# EasyEDA Pro project IPM_12V分电板.eprj

# Schematic Schematic1
Board Name: Board1; Create Date: 2025-09-07; Page Name: P1; Project Name: IPM_12V分电板; Schematic Name: Schematic1; Update Date: 2025-09-14; Company: 嘉立创EDA; Page Size: A4; Version: V1.0
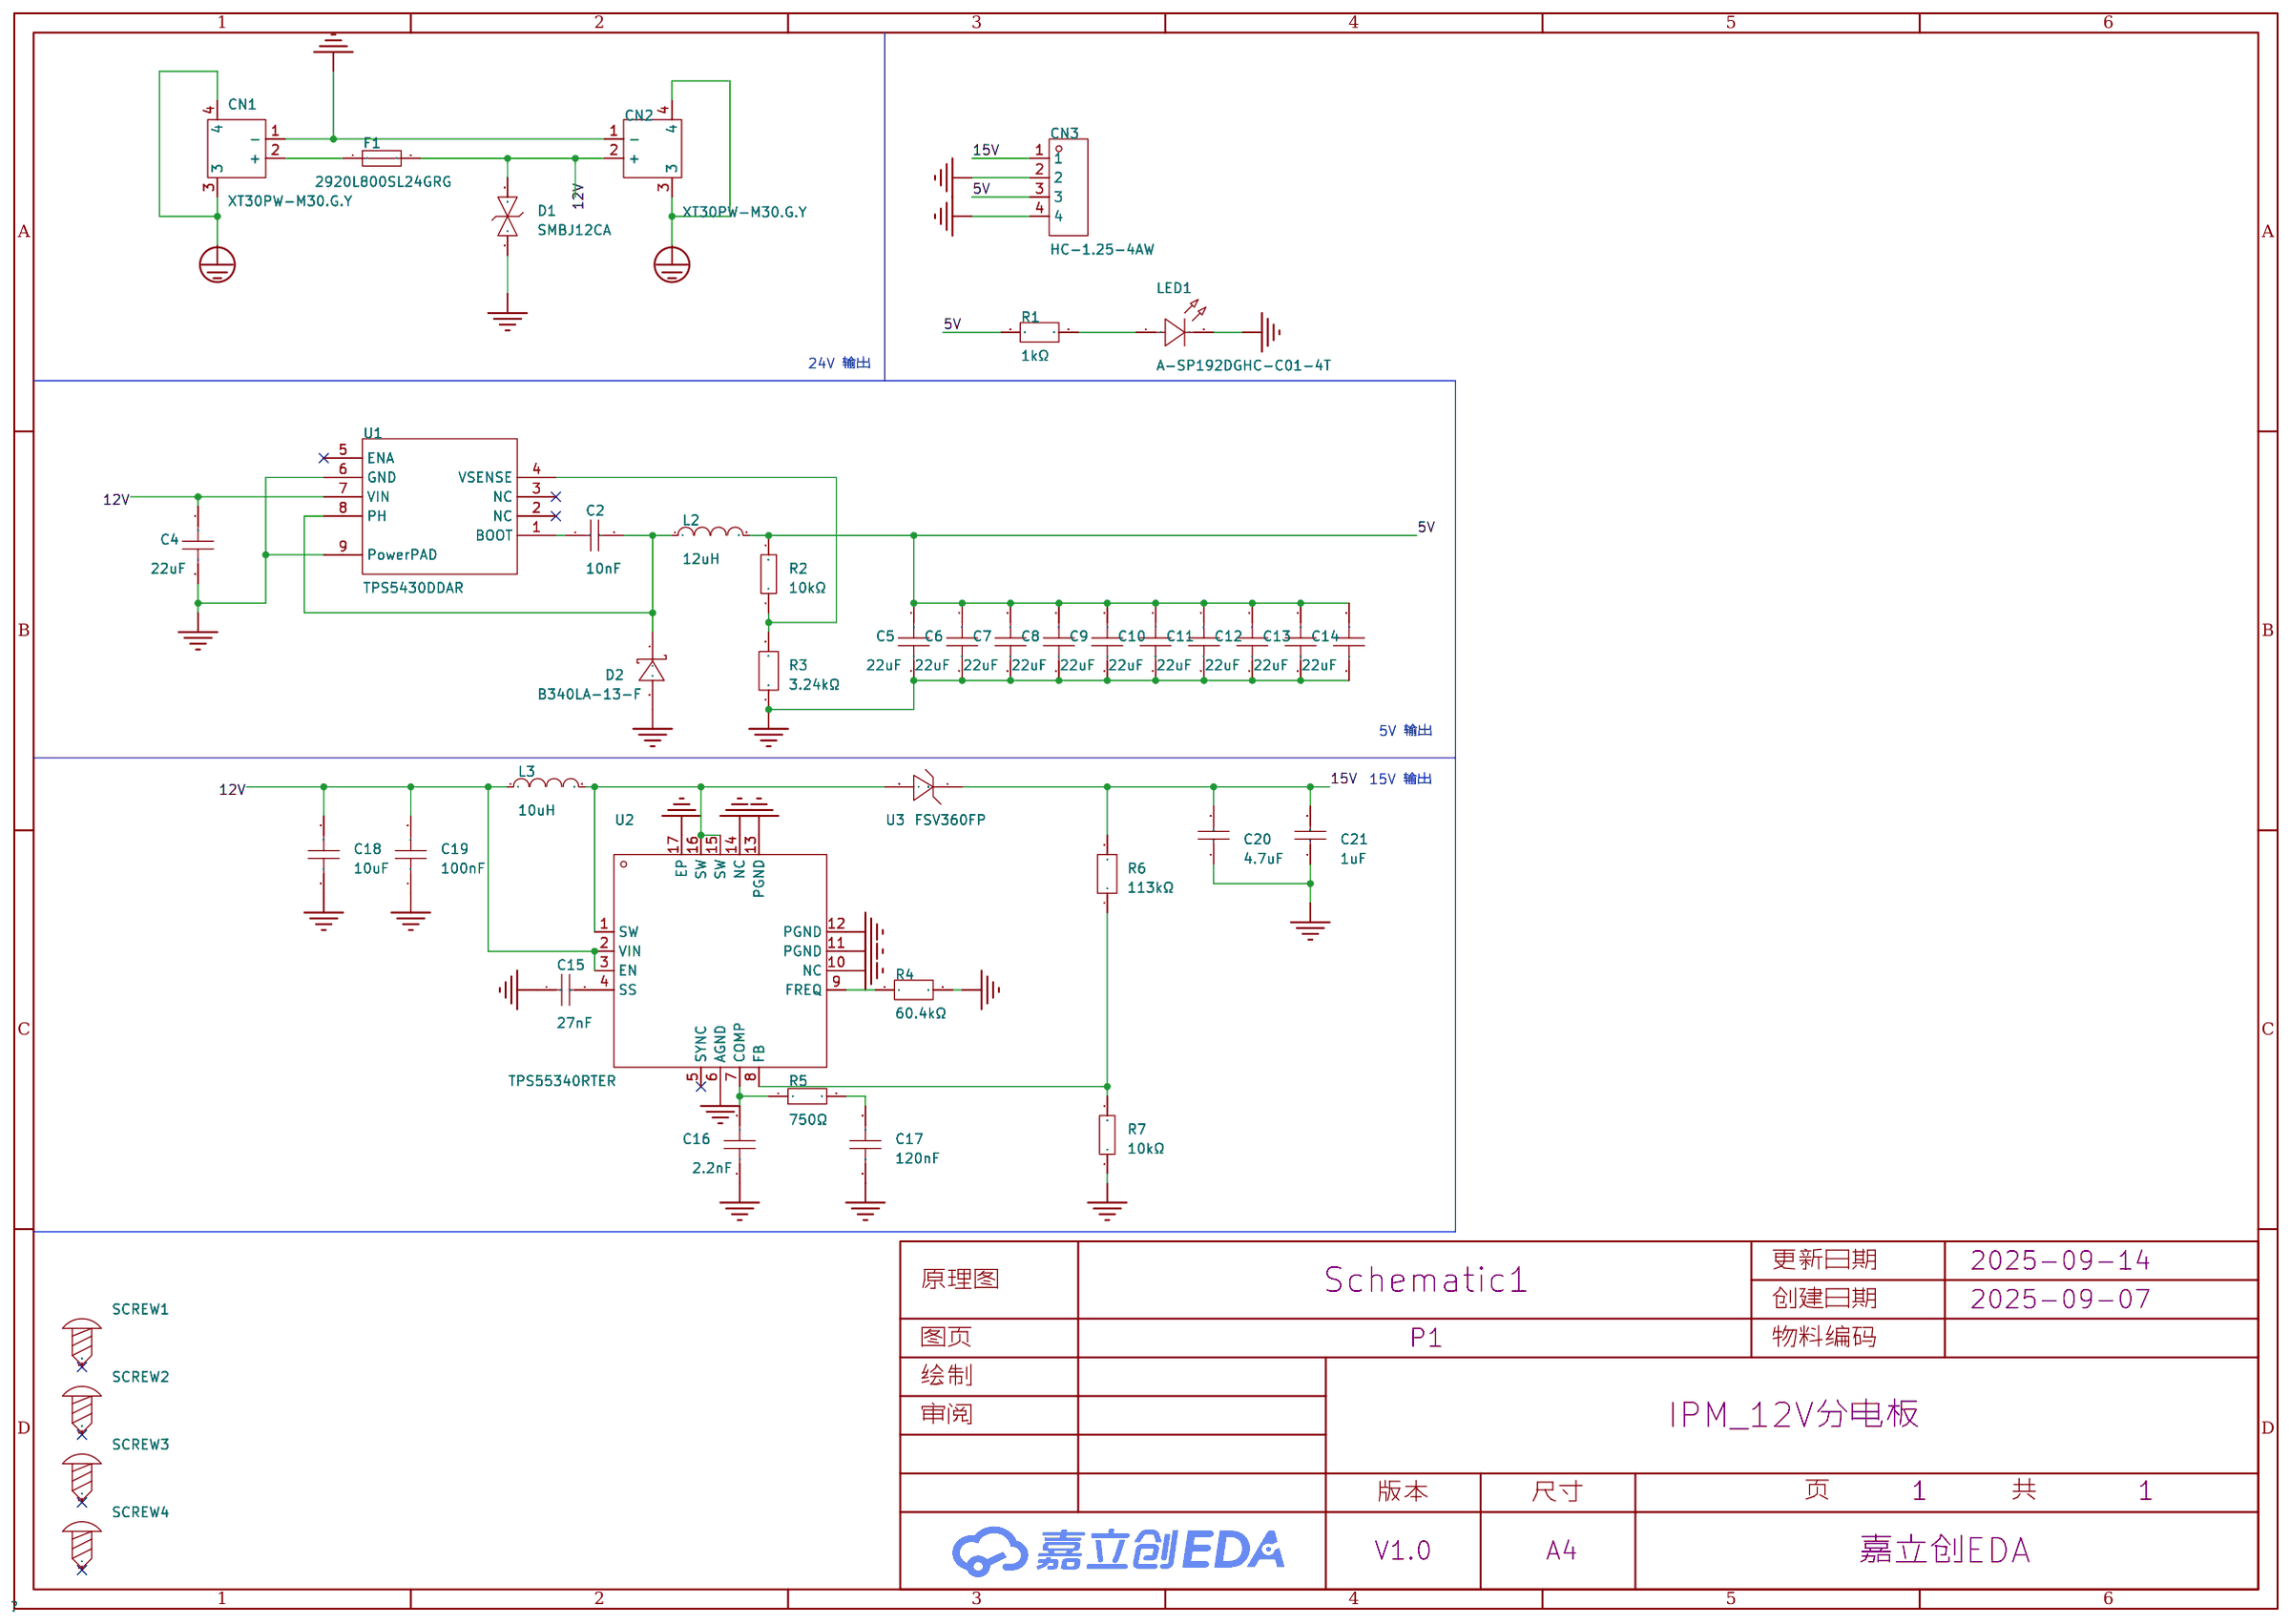
[diagram p0: schematic sheet]

## Parts
C2  10nF  [C0603]
C4  22uF  [C0603]
C5  22uF  [C0603]
C6  22uF  [C0603]
C7  22uF  [C0603]
C8  22uF  [C0603]
C9  22uF  [C0603]
C10  22uF  [C0603]
C11  22uF  [C0603]
C12  22uF  [C0603]
C13  22uF  [C0603]
C14  22uF  [C0603]
C15  27nF  [C0603]
C16  2.2nF  [C0603]
C17  120nF  [C0603]
C18  10uF  [C0603]
C19  100nF  [C0603]
C20  4.7uF  [C0805]
C21  1uF  [C0805]
CN1  XT30PW-M30.G.Y  [CONN-TH_XT30PW-M]
CN2  XT30PW-M30.G.Y  [CONN-TH_XT30PW-M]
CN3  HC-1.25-4AW  [CONN-TH_4P-P1.25_HCTL_HC-1.25-4AW]
D1  SMBJ12CA  [SMB_L4.6-W3.6-LS5.4-BI]
D2  B340LA-13-F  [SMA_L4.3-W2.6-LS5.2-RD]
F1  2920L800SL24GRG  [F2920]
L2  12uH  [IND-SMD_L8.0-W8.0_FNR80XXS]
L3  10uH  [IND-SMD_L5.4-W5.2_FXL0530]
LED1  A-SP192DGHC-C01-4T  [LED0603-FD]
R1  1kΩ  [R0603]
R2  10kΩ  [R0603]
R3  3.24kΩ  [R0603]
R4  60.4kΩ  [R0603]
R5  750Ω  [R0603]
R6  113kΩ  [R0603]
R7  10kΩ  [R0603]
SCREW1  -  [M2螺丝]
SCREW2  -  [M2螺丝]
SCREW3  -  [M2螺丝]
SCREW4  -  [M2螺丝]
U1  TPS5430DDAR  [ESOP-8_L4.9-W3.9-P1.27-LS6.0-TL-EP]
U2  TPS55340RTER  [VQFN-16_L3.0-W3.0-P0.50-BL-EP1.7]
U3  FSV360FP  [POWERDI-123_L2.8-W1.8-LS3.7-RD-1]

## Library data of the parts
C2 = CL10B103KB8NNNC: LCSC Part Name: 10nF ±10% 50V; Supplier Part: C1589; Manufacturer: SAMSUNG(三星); Supplier Footprint: 0603; JLCPCB Part Class: 扩展库; Datasheet: https://item.szlcsc.com/datasheet/CL10B103KB8NNNC/1941.html; Supplier: LCSC; Tolerance: ±10%; Voltage Rating: 50V; Temperature Coefficient: X7R
C4-C14 = CL10A226MO7JZNC: LCSC Part Name: 22uF ±20% 16V; Supplier Part: C2762594; Manufacturer: SAMSUNG(三星); Supplier Footprint: 0603; JLCPCB Part Class: 扩展库; Datasheet: https://item.szlcsc.com/datasheet/CL10A226MO7JZNC/2889856.html; Supplier: LCSC; Tolerance: ±20%; Voltage Rating: 16V; Temperature Coefficient: X5R
C15 = CC0603KRX7R9BB273: LCSC Part Name: 27nF ±10% 50V; Supplier Part: C107086; Manufacturer: YAGEO(国巨); Supplier Footprint: 0603; JLCPCB Part Class: 扩展库; Datasheet: https://item.szlcsc.com/datasheet/CC0603KRX7R9BB273/108302.html; Supplier: LCSC; Tolerance: ±10%; Voltage Rating: 50V; Temperature Coefficient: X7R
C16 = GRM1885C1H222JA01D: LCSC Part Name: 2.2nF ±5% 50V; Supplier Part: C77033; Manufacturer: muRata(村田); Supplier Footprint: 0603; JLCPCB Part Class: 扩展库; Datasheet: https://atta.szlcsc.com/upload/public/pdf/source/20200305/C490387_23319AE8C154DEB24C505E6C82A8106A.pdf; Supplier: LCSC; Tolerance: ±5%; Voltage Rated: 50V; Temperature Coefficient: C0G
C17 = CGA0603X7R124K500JT: LCSC Part Name: 120nF ±10% 50V; Supplier Part: C36911430; Manufacturer: HRE(芯声); Supplier Footprint: 0603; JLCPCB Part Class: 扩展库; Datasheet: https://atta.szlcsc.com/upload/public/pdf/source/20240730/28DD32980FC0791A6BDEF3FC10157BDF.pdf; Supplier: LCSC; Tolerance: ±10%; Voltage Rating: 50V; Temperature Coefficient: X7R
C18 = CL10A106MA8NRNC: LCSC Part Name: 10uF ±20% 25V; Supplier Part: C96446; Manufacturer: SAMSUNG(三星); Supplier Footprint: 0603; JLCPCB Part Class: 基础库; Datasheet: https://item.szlcsc.com/datasheet/CL10A106MA8NRNC/97651.html; Supplier: LCSC; Tolerance: ±20%; Voltage Rating: 25V; Temperature Coefficient: X5R
C19 = CL10B104KB8NNNC: LCSC Part Name: 100nF ±10% 50V; Supplier Part: C1591; Manufacturer: SAMSUNG(三星); Supplier Footprint: 0603; JLCPCB Part Class: 扩展库; Datasheet: https://item.szlcsc.com/datasheet/CL10B104KB8NNNC/1943.html; Supplier: LCSC; Tolerance: ±10%; Voltage Rating: 50V; Temperature Coefficient: X7R
C20 = CL21A475KBQNNNE: LCSC Part Name: 4.7uF ±10% 50V; Supplier Part: C98192; Manufacturer: SAMSUNG(三星); Supplier Footprint: 0805; JLCPCB Part Class: 扩展库; Datasheet: https://item.szlcsc.com/datasheet/CL21A475KBQNNNE/99401.html; Supplier: LCSC; Tolerance: ±10%; Voltage Rating: 50V; Temperature Coefficient: X5R
C21 = CL21B105KBFNNNE: LCSC Part Name: 1uF ±10% 50V; Supplier Part: C28323; Manufacturer: SAMSUNG(三星); Supplier Footprint: 0805; JLCPCB Part Class: 基础库; Datasheet: https://item.szlcsc.com/datasheet/CL21B105KBFNNNE/29074.html; Supplier: LCSC; Tolerance: ±10%; Voltage Rating: 50V; Temperature Coefficient: X7R
CN1 CN2 = XT30PW-M30.G.Y: 类别:-;类型1:-;; LCSC Part Name: AMASS(艾迈斯)航模插头 卧式弯脚 XT30PW-M公头; Supplier Part: C431092; Manufacturer: AMASS(艾迈斯); JLCPCB Part Class: 扩展库; Datasheet: https://atta.szlcsc.com/upload/public/pdf/source/20220222/6A9F22F7850E25B33E1BE430ADF8560B.pdf; Supplier: LCSC; Type: 航模插头; RatedVoltage: DC 500V; InterfaceType: 公头; RatedCurrent: 15A; RecommendedWireGauge: 16/18/20AWG; contact resistance: 1.2mΩ; specifications: 2pin
CN3 = HC-1.25-4AW: LCSC Part Name: 1x4P 间距:1.25mm 弯插 系列:PicoBlade(MX 1.25); Supplier Part: C2845537; Manufacturer: HCTL(华灿天禄); Supplier Footprint: 弯插,P=1.25mm; JLCPCB Part Class: 扩展库; Datasheet: https://item.szlcsc.com/datasheet/HC-1.25-4AW/3039218.html; Supplier: LCSC; Pins Structure: 1x4P; Pitch: 1.25mm; Mounting Type: 弯插; Reference Series: PicoBlade(MX 1.25); Number of Pins: 4P; Number of Rows: 1; Number of PINs Per Row: 4; Current Rating: 1A; Contact Material: 黄铜; Contact Plating: 锡; Operating Temperature: -25℃~+85℃; Voltage Rating: 125V; Plastic Material: PA46; Flame Retardant Rating: UL94V-0; Z-Height of the Board: 3.2mm; X-Length of Bottom Edge on Board (Spacing Line): 6.75mm; Y-Width of Bottom Edge on Board: 4.7mm
D1 = SMBJ12CA_C19077566: LCSC Part Name: 双向TVS 12V截止 峰值浪涌电流：30.15A@10/1000us; Supplier Part: C19077566; Manufacturer: R+O(宏嘉诚); Supplier Footprint: DO-214AA(SMB); JLCPCB Part Class: 扩展库; Datasheet: https://item.szlcsc.com/datasheet/SMBJ12CA/20275651.html; Supplier: LCSC; Polarity: 双向; Reverse Stand-Off Voltage (Vrwm): 12V; Clamping Voltage: 19.9V; Peak Pulse Current (Ipp): 30.15A@10/1000us; Peak Pulse Power Dissipation (Ppp): 600W@10/1000us; Voltage - Breakdown: 14.7V; Reverse Leakage Current (Ir): 5uA; Number of Channels: 单路; Operating Temperature: -55℃~+150℃; level of protection: IEC 61000-4-2; Type: TVS
D2 = B340LA-13-F: LCSC Part Name: 电压:40V 电流:3A; Supplier Part: C17101; Manufacturer: DIODES(美台); Supplier Footprint: SMA(DO-214AC); JLCPCB Part Class: 扩展库; Datasheet: https://atta.szlcsc.com/upload/public/pdf/source/20171023/C97318_15087455366241052881.pdf; Supplier: LCSC; Forward Voltage (Vf@If): 450mV@3A; Reverse Voltage (Vr): 40V; Average Rectified Current (Io): 3A; Reverse Leakage Current (Ir): 2mA@40V
F1 = 2920L800SL24GRG: LCSC Part Name: 24V 8.00A 2920 低内阻; Supplier Part: C47345588; Manufacturer: LUTE(陆特); Supplier Footprint: 2920; JLCPCB Part Class: 扩展库; Datasheet: https://item.szlcsc.com/datasheet/2920L800SL24GRG/49561096.html; Supplier: LCSC; Voltage - Max: 24V; Current - Max: 50A; Hold Current: 8A; Trip Current: 16A; Power Dissipation: 2W; Resistance - Initial (Ri) (Min): 0.6mΩ; Resistance - Post Trip (R1) (Max): 0.8mΩ; Time to Trip(Max): 5s; Operating Temperature: -40℃~+85℃
L2 = FNR8040S120MT: LCSC Part Name: 12uH ±20% 4A; Supplier Part: C168128; Manufacturer: cjiang(长江微电); Supplier Footprint: SMD,8x8mm; JLCPCB Part Class: 扩展库; Datasheet: https://atta.szlcsc.com/upload/public/pdf/source/20190327/C167925_9EFF0AABC4CA629C2CC95961DBF7D39D.pdf; Supplier: LCSC; Tolerance: ±20%; Current Rating: 3A; Current - Saturation(Isat): 4A; DC Resistance(DCR): 53mΩ; Type: 磁胶屏蔽绕线合金电感
L3 = FXL0530-100-M: LCSC Part Name: 10uH ±20% 3.5A; Supplier Part: C177248; Manufacturer: cjiang(长江微电); Supplier Footprint: SMD,5.4x5.2mm; JLCPCB Part Class: 扩展库; Datasheet: https://item.szlcsc.com/datasheet/FXL0530-100-M/188640.html; Supplier: LCSC; Tolerance: ±20%; Current Rating: 3.2A; Current - Saturation(Isat): 3.5A; DC Resistance(DCR): 125mΩ; Type: 一体成型电感
LED1 = A-SP192DGHC-C01-4T: LCSC Part Name: 0603高亮绿灯正贴; Supplier Part: C19171301; Manufacturer: Amicc(欧密格光电); Supplier Footprint: 0603; JLCPCB Part Class: 扩展库; Datasheet: https://atta.szlcsc.com/upload/public/pdf/source/20231108/CAA90604E374CB6B31BBE970B55159E7.pdf; Supplier: LCSC; Emitted Color: 绿色; Forward Voltage (VF): 2.4V~3V; Power Dissipation: 70mW; Dominant Wavelength: 520nm~535nm; Lens Color: 无色透明透镜; Luminous Intensity: 225mcd~450mcd; Viewing Angle: 120°; Mounting Sytle: 正贴; Operating Temperature: -40℃~+85℃
R1 = FRC0603F1001TS: LCSC Part Name: 1kΩ ±1% 100mW 厚膜电阻; Supplier Part: C2907002; Manufacturer: FOJAN(富捷); Supplier Footprint: 0603; JLCPCB Part Class: 扩展库; Supplier: LCSC; Type: 厚膜电阻; Tolerance: ±1%; Power(Watts): 100mW; Voltage-Supply(Max): 75V; Temperature Coefficient: ±100ppm/℃; Operating Temperature: -55℃~+155℃
R2 R7 = 0603WAF1002T5E: LCSC Part Name: 厚膜电阻 10kΩ ±1% 100mW; Supplier Part: C25804; Manufacturer: UNI-ROYAL(厚声); Supplier Footprint: 0603; JLCPCB Part Class: 基础库; Datasheet: https://item.szlcsc.com/datasheet/0603WAF1002T5E/26547.html; Supplier: LCSC; Type: 厚膜电阻; Tolerance: ±1%; Power(Watts): 100mW; Voltage-Supply(Max): 75V; Temperature Coefficient: ±100ppm/℃; Operating Temperature: -55℃~+155℃
R3 = FRC0603F3241TS: LCSC Part Name: 3.24kΩ ±1% 100mW 厚膜电阻; Supplier Part: C2933197; Manufacturer: FOJAN(富捷); Supplier Footprint: 0603; JLCPCB Part Class: 扩展库; Datasheet: https://item.szlcsc.com/datasheet/FRC0603F3241TS/3279299.html; Supplier: LCSC; Type: 厚膜电阻; Tolerance: ±1%; Power(Watts): 100mW; Voltage-Supply(Max): 75V; Temperature Coefficient: ±100ppm/℃; Operating Temperature: -55℃~+155℃
R4 = RT0603BRD0760K4L: LCSC Part Name: 薄膜电阻 60.4kΩ ±0.1% 100mW; Supplier Part: C861495; Manufacturer: YAGEO(国巨); Supplier Footprint: 0603; JLCPCB Part Class: 扩展库; Datasheet: https://item.szlcsc.com/datasheet/RT0603BRD0760K4L/921833.html; Supplier: LCSC; Type: 薄膜电阻; Tolerance: ±0.1%; Power(Watts): 100mW; Temperature Coefficient: ±25ppm/℃; Operating Temperature: -55℃~+155℃
R5 = PTFR0603B750RP9: LCSC Part Name: 薄膜电阻 750Ω ±0.1% 100mW; Supplier Part: C351629; Manufacturer: RESI(开步睿思); Supplier Footprint: 0603; JLCPCB Part Class: 扩展库; Datasheet: https://atta.szlcsc.com/upload/public/pdf/source/20240506/11BDC7478D84177AC2A5326A65B6EB29.pdf; Supplier: LCSC; Type: 薄膜电阻; Tolerance: ±0.1%; Power(Watts): 100mW; Voltage-Supply(Max): 100V; Temperature Coefficient: ±25ppm/℃; Operating Temperature: -55℃~+125℃
R6 = RT0603BRD07113KL: LCSC Part Name: 薄膜电阻 113kΩ ±0.1% 100mW; Supplier Part: C705718; Manufacturer: YAGEO(国巨); Supplier Footprint: 0603; JLCPCB Part Class: 扩展库; Datasheet: https://atta.szlcsc.com/upload/public/pdf/source/20250609/0E6D5617EADA80FA3B707391883DF2D5.pdf; Supplier: LCSC; Type: 薄膜电阻; Tolerance: ±0.1%; Power(Watts): 100mW; Voltage-Supply(Max): 75V; Temperature Coefficient: ±25ppm/℃; Operating Temperature: -55℃~+155℃
SCREW1-SCREW4 = M2螺丝: Supplier Footprint: 插件
U1 = TPS5430DDAR: LCSC Part Name: 宽输入范围、3A输出电流的降压转换器; Supplier Part: C9864; Manufacturer: TI(德州仪器); Supplier Footprint: SOIC-8-EP; JLCPCB Part Class: 基础库; Datasheet: https://www.ti.com/cn/lit/gpn/tps5430; Supplier: LCSC; Function: 降压型; Output Type: 可调; Input Voltage: 5.5V~36V; Output Voltage: 1.221V~32.04V; Output Current: 3A; Switching Frequency: 500kHz; Operating Temperature: -40℃~+125℃@(TJ); Synchronous Rectification: 否; Number of Outputs: 1; Topology: 降压式; Switch tube (built-in/external): 内置
U2 = TPS55340RTER: LCSC Part Name: 5A 40V 非同步降压转换器; Supplier Part: C169167; Manufacturer: TI(德州仪器); Supplier Footprint: WQFN-16-EP(3x3); JLCPCB Part Class: 扩展库; Datasheet: https://www.ti.com/cn/lit/gpn/tps55340; Supplier: LCSC; Function: 升压型; Output Type: 可调; Voltage - Supply: 2.9V~32V; Output Voltage: 2.9V~38V; Output Current: 5.25A; Frequency - Switching: 1.14MHz; Operating Temperature: -40℃~+125℃@(TA); Synchronous Rectifier: 否; Number of Outputs: 1; Topology: 升压式；SEPIC；反激式; Switch tube (built-in/external): 内置
U3 = FSV360FP: LCSC Part Name: 电压:60V 电流:3A; Supplier Part: C891303; Manufacturer: onsemi(安森美); Supplier Footprint: SOD-123HE; JLCPCB Part Class: 扩展库; Datasheet: https://atta.szlcsc.com/upload/public/pdf/source/20210806/C891303_88CAC5C1F49EACDD3A0D3D95F29CFB22.pdf; Supplier: LCSC; Diode Configuration: 独立式; Forward Voltage (Vf) @ If: 650mV@3A; Reverse Voltage (Vr): 60V; Rectified Current: 3A; Reverse Leakage Current: 100uA@60V

## Nets
5V: C5.1 C6.1 C7.1 C8.1 C9.1 C10.1 C11.1 C12.1 C13.1 C14.1 CN3.3 L2.2 R1.1 R2.2
12V: C4.1 C18.2 C19.2 CN2.2(+) D1.2 F1.2 L3.1 U1.7(VIN) U2.2(VIN) U2.3(EN)
15V: C20.2 C21.2 CN3.1 R6.2 U3.1(C)
GND: C4.2 C5.2 C6.2 C7.2 C8.2 C9.2 C10.2 C11.2 C12.2 C13.2 C14.2 C15.1 C16.1 C17.1 C18.1 C19.1 C20.1 C21.1 CN1.1(-) CN2.1(-) CN3.2 CN3.4 D1.1 D2.2(A) LED1.2(K) R3.1 R4.2 R7.1 U1.6(GND) U1.9(PowerPAD) U2.6(AGND) U2.10(NC) U2.11(PGND) U2.12(PGND) U2.13(PGND) U2.14(NC) U2.17(EP)
PGND: CN1.3 CN1.4 CN2.3 CN2.4
$1N1431: C2.2 D2.1(K) L2.1 U1.8(PH)
$1N1787: R2.1 R3.2 U1.4(VSENSE)
$1N3489: LED1.1(A) R1.2
$1N5102: CN1.2(+) F1.1
$1N5856: C2.1 U1.1(BOOT)
$1N7867: L3.2 U2.1(SW) U2.15(SW) U2.16(SW) U3.2(A)
$1N8053: C15.2 U2.4(SS)
$1N8197: R4.1 U2.9(FREQ)
$1N8300: C16.2 R5.1 U2.7(COMP)
$1N8474: C17.2 R5.2
$1N9029: R6.1 R7.2 U2.8(FB)

Not connected (* = marked no-connect by the designer): SCREW1 1*; SCREW2 1*; SCREW3 1*; SCREW4 1*; U1 2(NC)* 3(NC)* 5(ENA)*; U2 5(SYNC)*

## Notes on the sheet
- 24V 输出
- 5V 输出
- 15V 输出

# Board PCB1
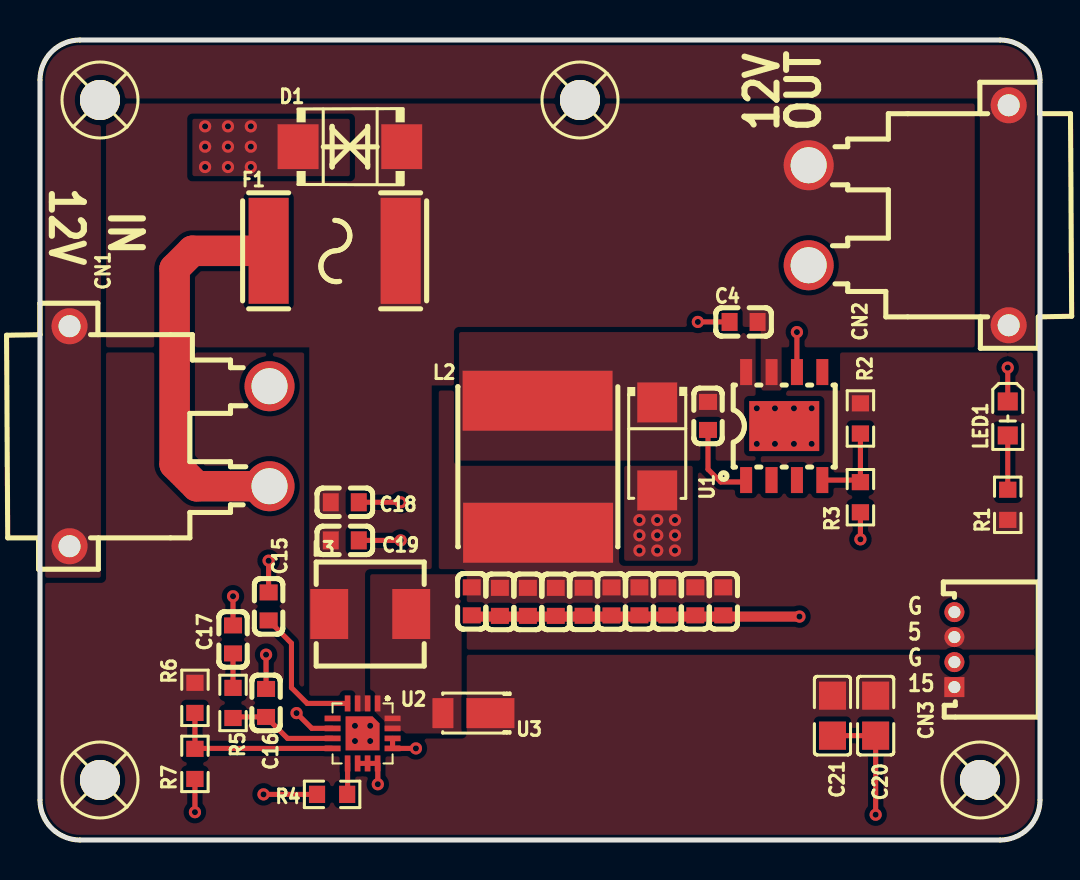
[diagram p1: board, top side]
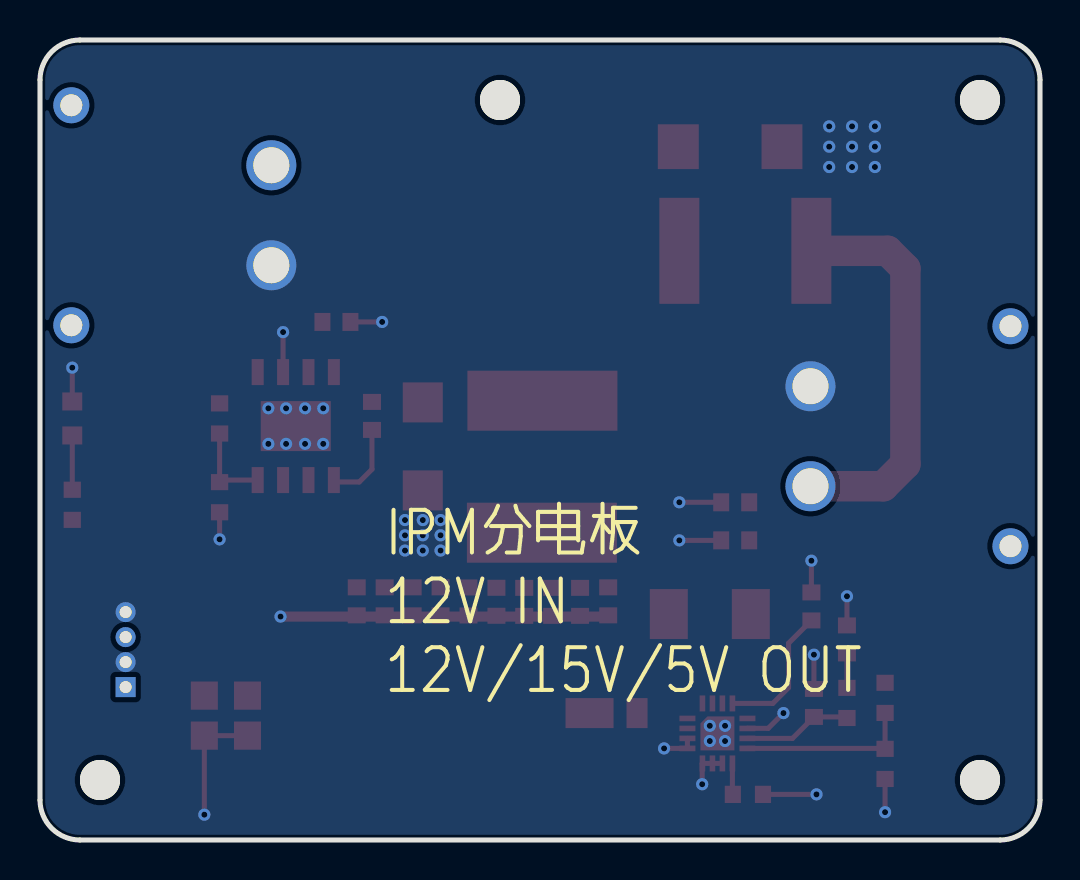
[diagram p2: board, bottom side, seen from below]

Outline 50 x 40 mm; copper layers: Top Layer, Bottom Layer. Coordinates in mm from the lower left corner of the outline.
Outline path: 0,38 0,2 arc(0.59,0.59) 2,0 48,0 arc(49.41,0.59) 50,2 50,38 arc(49.41,39.41) 48,40 2,40 arc(0.59,39.41) 0,38
Stack: Top Layer 0.035mm / Dielectric1 1.51mm FR4 er 4.5 / Bottom Layer 0.035mm

## Design rules (mm)
template: 自定义配置
spacing copperThickness1oz (default): track to track 0.102, other pairs 0.152 to 0.3
spacing copperThickness2oz: track to track 0.203, other pairs 0.152 to 0.3
track width copperThickness1oz (default): min 0.127, default 0.254, max 2.54
track width copperThickness2oz: min 0.203, default 0.254, max 2.54
differential pair differentialPair (default): width min 0.127, default 0.254, max 2.54; gap min 0.152, default 0.152
via viaSize (default): diameter min 0.5, default 0.61, max 10; hole min 0.3, default 0.305, max 6.3

## Placement (name value [footprint] x y rotation side)
C2  10nF  [C0603]  33.4 21.2 90 top
C4  22uF  [C0603]  35.18 25.9 180 top
C5  22uF  [C0603]  32.77 11.93 270 top
C6  22uF  [C0603]  31.37 11.93 270 top
C7  22uF  [C0603]  34.16 11.93 270 top
C8  22uF  [C0603]  28.57 11.93 270 top
C9  22uF  [C0603]  23 11.91 270 top
C10  22uF  [C0603]  21.59 11.93 270 top
C11  22uF  [C0603]  24.39 11.91 270 top
C12  22uF  [C0603]  25.79 11.91 270 top
C13  22uF  [C0603]  27.18 11.91 270 top
C14  22uF  [C0603]  29.97 11.93 270 top
C15  27nF  [C0603]  11.43 11.68 270 top
C16  2.2nF  [C0603]  11.3 6.85 270 top
C17  120nF  [C0603]  9.65 10.03 270 top
C18  10uF  [C0603]  15.24 16.89 180 top
C19  100nF  [C0603]  15.24 14.98 180 top
C20  4.7uF  [C0805]  41.78 6.22 90 top
C21  1uF  [C0805]  39.62 6.22 90 top
CN1  XT30PW-M30.G.Y  [CONN-TH_XT30PW-M]  6.48 20.19 270 top
CN2  XT30PW-M30.G.Y  [CONN-TH_XT30PW-M]  43.43 31.24 90 top
CN3  HC-1.25-4AW  [CONN-TH_4P-P1.25_HCTL_HC-1.25-4AW]  45.72 9.52 90 top
D1  SMBJ12CA  [SMB_L4.6-W3.6-LS5.4-BI]  15.49 34.67 0 top
D2  B340LA-13-F  [SMA_L4.3-W2.6-LS5.2-RD]  30.86 19.68 270 top
F1  2920L800SL24GRG  [F2920]  14.73 29.46 0 top
L2  12uH  [IND-SMD_L8.0-W8.0_FNR80XXS]  24.89 18.66 270 top
L3  10uH  [IND-SMD_L5.4-W5.2_FXL0530]  16.51 11.3 0 top
LED1  A-SP192DGHC-C01-4T  [LED0603-FD]  48.39 21.08 90 top
R1  1kΩ  [R0603]  48.39 16.76 90 top
R2  10kΩ  [R0603]  41.02 21.08 90 top
R3  3.24kΩ  [R0603]  41.02 17.14 90 top
R4  60.4kΩ  [R0603]  14.6 2.28 180 top
R5  750Ω  [R0603]  9.65 6.85 90 top
R6  113kΩ  [R0603]  7.75 7.11 90 top
R7  10kΩ  [R0603]  7.75 3.81 90 top
SCREW1  -  [M2螺丝]  3 37 0 top
SCREW2  -  [M2螺丝]  3 3 0 top
SCREW3  -  [M2螺丝]  47 3 0 top
SCREW4  -  [M2螺丝]  27 37 0 top
U1  TPS5430DDAR  [ESOP-8_L4.9-W3.9-P1.27-LS6.0-TL-EP]  37.21 20.7 90 top
U2  TPS55340RTER  [VQFN-16_L3.0-W3.0-P0.50-BL-EP1.7]  16.13 5.33 180 top
U3  FSV360FP  [POWERDI-123_L2.8-W1.8-LS3.7-RD-1]  21.34 6.34 180 top

## Footprints (pads in the part's own frame, mm; a bottom-side part is the same pattern mirrored in y, then rotated)
C0603
  rect 0.8x0.9 smd: 1(-0.7,0) 2(0.7,0)
C0805
  rect 1.41x1.35 smd: 1(-1,0) 2(1,0)
CONN-TH_4P-P1.25_HCTL_HC-1.25-4AW
  rect 1x1 hole 0.6: 1(-1.875,0)
  round 1 hole 0.6: 2(-0.625,0) 3(0.625,0) 4(1.875,0)
CONN-TH_XT30PW-M
  round 2.5 hole 1.8: 1(-2.5,5) 2(2.5,5)
  round 1.8 hole 1.1: 3(5.5,-5) 4(-5.5,-5)
ESOP-8_L4.9-W3.9-P1.27-LS6.0-TL-EP
  rect 1.3x0.6 smd: 1(-2.7,1.905) 2(-2.7,0.635) 3(-2.7,-0.635) 4(-2.7,-1.905) 5(2.7,-1.905) 6(2.7,-0.635) 7(2.7,0.635) 8(2.7,1.905)
  rect 2.5x3.5 smd: 9(0,0)
F2920
  rect 2x5.3 smd: 1(-3.3,0) 2(3.3,0)
IND-SMD_L5.4-W5.2_FXL0530
  rect 1.9x2.5 smd: 1(-2.05,0) 2(2.05,0)
IND-SMD_L8.0-W8.0_FNR80XXS
  rect 3x7.5 smd: 1(-3.3,-0.013) 2(3.3,0.013)
LED0603-FD
  rect 0.9x1 smd: 1(-0.85,0) 2(0.85,0)
M2螺丝
  round 2 hole 2: 1(0,0)
POWERDI-123_L2.8-W1.8-LS3.7-RD-1
  rect 2.4x1.5 smd: 1(-1.188,0)
  rect 1.05x1.5 smd: 2(1.188,0)
R0603
  rect 0.806x0.864 smd: 1(-0.753,0) 2(0.753,0)
SMA_L4.3-W2.6-LS5.2-RD
  rect 2x2 smd: 1(-2.2,0) 2(2.2,0)
SMB_L4.6-W3.6-LS5.4-BI
  rect 2.047x2.241 smd: 1(-2.591,0) 2(2.591,0)
VQFN-16_L3.0-W3.0-P0.50-BL-EP1.7
  rect 0.28x0.8 smd: 1(-0.749,-1.5) 2(-0.249,-1.5) 3(0.249,-1.5) 4(0.75,-1.5) 9(0.75,1.5) 10(0.249,1.5) 11(-0.249,1.5) 12(-0.749,1.5)
  rect 0.8x0.28 smd: 5(1.5,-0.749) 6(1.5,-0.249) 7(1.5,0.249) 8(1.5,0.75) 13(-1.5,0.75) 14(-1.5,0.249) 15(-1.5,-0.249) 16(-1.5,-0.749)
  custom 1.7x1.7 smd: 17(0,0)

## Nets
As in the schematic.

Pads without a net: SCREW1 1; SCREW2 1; SCREW3 1; SCREW4 1; U1 2 3 5; U2 5

## Via types
v1: diameter 0.61, hole 0.305, Top Layer to Bottom Layer, 46 vias

## Routing (per net, layer and track width the routed paths; a pad name or vN(x,y) marks a point on that pad's centre or on a via; arc(x,y) is an arc through that point)
GND: length 48.3
  Top Layer w0.254: R3.1 v1(41.02,15.03) ; v1(16.89,2.79) 16.89,3.82 U2.12 U2.11 U2.10 ; C18.1 v1(18.03,16.89) ; C16.1 v1(11.3,9.27) ; C21.1 C20.1 v1(41.78,1.27) ; U2.6 14.62,5.58 13.59,5.58 v1(12.83,6.34) ; C4.2 v1(32.89,25.9) ; U2.14 U2.13 v1(18.8,4.58) ; C15.1 v1(11.43,13.97) ; 48.39,21.93 v1(48.39,23.62) ; R7.1 v1(7.75,1.39) ; v1(37.85,25.39) U1.6 ; C17.1 v1(9.65,12.19) ; R4.2 v1(11.18,2.28) ; C19.1 v1(18.03,14.98)
  Top Layer w0.508: v1(37.97,11.17) 21.65,11.17 C10.2
  vias: v1(8.25,35.68) v1(8.25,34.67) v1(8.25,33.65) v1(9.4,35.68) v1(9.4,34.67) v1(9.4,33.65) v1(10.54,35.68) v1(10.54,34.67) v1(10.54,33.65) v1(15.75,5.71) v1(15.75,4.95) v1(16.51,5.71) v1(16.51,4.95) v1(29.97,16) v1(29.97,15.23) v1(29.97,14.47) v1(30.86,16) v1(30.86,15.23) v1(30.86,14.47) v1(31.75,16) v1(31.75,15.23) v1(31.75,14.47) v1(35.84,21.58) v1(35.84,19.81) v1(36.75,21.58) v1(36.75,19.81) v1(37.7,21.58) v1(37.7,19.81) v1(38.58,21.58) v1(38.58,19.81)
$1N1787: length 4.4
  Top Layer w0.254: U1.4 40.92,18 R3.2 R2.1
$1N3489: length 2.5
  Top Layer w0.254: 48.39,17.77 LED1.1
$1N5102: length 20.1
  Top Layer w1.524: F1.1 7.62,29.46 6.73,28.57 6.73,18.79 7.83,17.69 CN1.2
$1N5856: length 4.2
  Top Layer w0.254: U1.1 35.21,17.9 34.04,17.9 33.4,18.54 C2.1 33.35,20.45
$1N8053: length 7
  Top Layer w0.254: U2.4 13.36,6.83 12.57,7.61 12.57,9.84 C15.2
$1N8197: length 1.6
  Top Layer w0.254: U2.9 15.38,2.3 R4.1
$1N8300: length 5.4
  Top Layer w0.254: R5.1 9.71,6.15 C16.2 12.38,5.08 U2.7
$1N8474: length 1.7
  Top Layer w0.254: C17.2 R5.2
$1N9029: length 8.7
  Top Layer w0.254: U2.8 7.77,4.58 R7.2 R6.1

## Copper pours and planes (outline as drawn; the poured copper is in the pictures)
5V on Top Layer: 19.94,22.47 40,22.47 40,24.38 49.66,24.38 49.66,22.47 52.2,22.47 52.2,9.52 19.94,9.52
12V on Top Layer: 13.46,6.34 13.46,24.63 -1.02,24.63 -1.02,40.76 53.21,40.76 53.21,24.63 37.08,24.63 37.08,22.47 36.07,22.47 36.07,22.73 19.59,22.73 19.59,6.34
15V on Top Layer: -4.32,29.08 55.25,29.08 55.25,-8.13 -4.32,-8.13
GND on Top Layer: 7.62,36.06 15.49,36.06 15.49,33.19 7.62,33.19
GND on Top Layer: 29.21,19.3 32.64,19.3 32.64,13.97 29.21,13.97
GND on Bottom Layer: -22.86,47.11 73.41,47.11 73.41,-6.1 -22.86,-6.1
PGND on Top Layer: 0,13.11 3.05,13.11 3.05,37.08 46.99,37.08 46.99,24.71 49.91,24.71 49.91,40 0,40
$1N1431 on Top Layer: 20.96,25.39 35.78,25.39 35.78,18.97 20.96,18.97
$1N7867 on Top Layer: 16.51,13.29 21.08,13.29 21.08,5.33 16.51,5.33

## Text on the board
Bottom Silkscreen Layer: IPM分电板 / 12V IN / 12V/15V/5V OUT
Top Silkscreen Layer: G / 5 / G / 15 | 12V | IN | OUT
